# EAGLE design mega32_u4_simple_v2 (EAGLE 6.5.0)
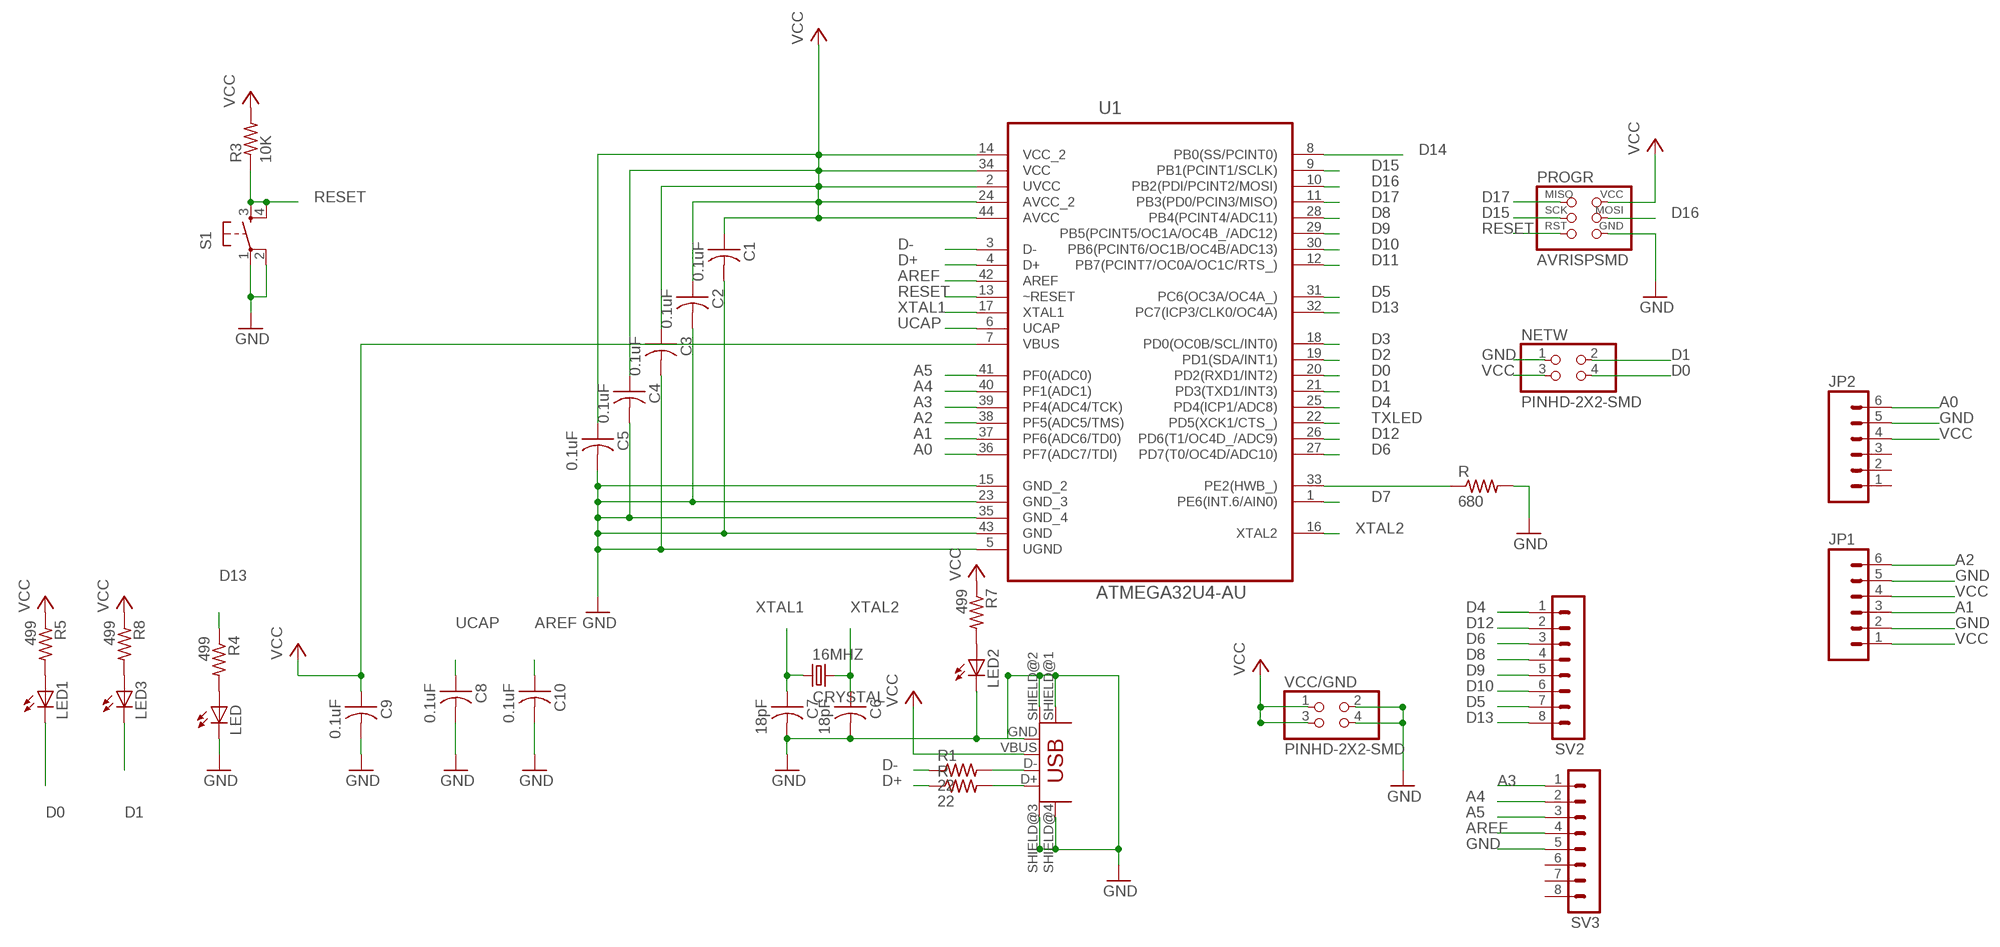
[diagram p0: schematic, sheet 1]

## Parts
16MHZ  CRYSTAL  [2-SMD-5X3MM]
C1  0.1uF  CAP-US1206FAB  [C1206FAB]
C2  0.1uF  CAP-US1206FAB  [C1206FAB]
C3  0.1uF  CAP-US1206FAB  [C1206FAB]
C4  0.1uF  CAP-US1206FAB  [C1206FAB]
C5  0.1uF  CAP-US1206FAB  [C1206FAB]
C6  18pF  CAP-US1206FAB  [C1206FAB]
C7  18pF  CAP-US1206FAB  [C1206FAB]
C8  0.1uF  CAP-US1206FAB  [C1206FAB]
C9  0.1uF  CAP-US1206FAB  [C1206FAB]
C10  0.1uF  CAP-US1206FAB  [C1206FAB]
JP1  M06SMD  [1X06-SMD]
JP2  M06SMD  [1X06-SMD]
LED  LED1206  [1206]
LED1  LED1206  [1206]
LED2  LED1206  [1206]
LED3  LED1206  [1206]
NETW  PINHD-2X2-SMD  [2X02SMD]
PROGR  AVRISPSMD  [2X03SMD]
R  680  RES-US1206FAB  [R1206FAB]
R1  22  RES-US1206FAB  [R1206FAB]
R3  10K  RES-US1206FAB  [R1206FAB]
R4  499  RESISTOR1206  [1206]
R5  499  RESISTOR1206  [1206]
R7  499  RESISTOR1206  [1206]
R8  499  RESISTOR1206  [1206]
R.  22  RES-US1206FAB  [R1206FAB]
S1  6MM_SWITCH6MM_SWITCH  [6MM_SWITCH]
SV2  MA08-1  [MA08-1]
SV3  MA08-1  [MA08-1]
U1  ATMEGA32U4-AU  [QFP80P1200X1200X120-44N]
U$1  USB_MINIB  [USB_MINIB]
VCC/GND  PINHD-2X2-SMD  [2X02SMD]

## Nets
A0: JP2.6 U1.36(PF7(ADC7/TDI))
A1: JP1.3 U1.37(PF6(ADC6/TD0))
A2: JP1.6 U1.38(PF5(ADC5/TMS))
A3: SV3.1 U1.39(PF4(ADC4/TCK))
A4: SV3.2 U1.40(PF1(ADC1))
A5: SV3.3 U1.41(PF0(ADC0))
AREF: C10.1 SV3.4 U1.42(AREF)
D0: LED1.2(C) NETW.4 U1.20(PD2(RXD1/INT2))
D1: LED3.2(C) NETW.2 U1.21(PD3(TXD1/INT3))
D2: U1.19(PD1(SDA/INT1))
D3: U1.18(PD0(OC0B/SCL/INT0))
D4: SV2.1 U1.25(PD4(ICP1/ADC8))
D5: SV2.7 U1.31(PC6(OC3A/OC4A_))
D6: SV2.3 U1.27(PD7(T0/OC4D/ADC10))
D7: U1.1(PE6(INT.6/AIN0))
D8: SV2.4 U1.28(PB4(PCINT4/ADC11))
D9: SV2.5 U1.29(PB5(PCINT5/OC1A/OC4B_/ADC12))
D10: SV2.6 U1.30(PB6(PCINT6/OC1B/OC4B/ADC13))
D11: U1.12(PB7(PCINT7/OC0A/OC1C/RTS_))
D12: SV2.2 U1.26(PD6(T1/OC4D_/ADC9))
D13: R4.1 SV2.8 U1.32(PC7(ICP3/CLK0/OC4A))
D14: U1.8(PB0(SS/PCINT0))
D15: PROGR.3(SCK) U1.9(PB1(PCINT1/SCLK))
D16: PROGR.4(MOSI) U1.10(PB2(PDI/PCINT2/MOSI))
D17: PROGR.1(MISO) U1.11(PB3(PD0/PCIN3/MISO))
D+: R..1 U1.4(D+)
D-: R1.1 U1.3(D-)
GND: C1.2 C2.2 C3.2 C4.2 C5.2 C6.2 C7.2 C8.2 C9.2 C10.2 JP1.2 JP1.5 JP2.5 LED2.2(C) LED.2(C) NETW.1 PROGR.6(GND) R.2 S1.1(P) S1.2(P1) SV3.5 U1.5(UGND) U1.15(GND_2) U1.23(GND_3) U1.35(GND_4) U1.43(GND) U$1.GND U$1.SHIELD@1(SHIELD) U$1.SHIELD@2(SHIELD1) U$1.SHIELD@3(SHIELD2) U$1.SHIELD@4(SHIELD3) VCC/GND.2 VCC/GND.4
N$1: R1.2 U$1.D-
N$2: R..2 U$1.D+
N$3: LED.1(A) R4.2
N$4: LED1.1(A) R5.2
N$5: LED2.1(A) R7.2
N$6: LED3.1(A) R8.2
N$35: R.1 U1.33(PE2(HWB_))
RESET: PROGR.5(RST) R3.1 S1.3(S) S1.4(S1) U1.13(~RESET)
TXLED: U1.22(PD5(XCK1/CTS_))
UCAP: C8.1 U1.6(UCAP)
VCC: C1.1 C2.1 C3.1 C4.1 C5.1 C9.1 JP1.1 JP1.4 JP2.4 NETW.3 PROGR.2(VCC) R3.2 R5.1 R7.1 R8.1 U1.2(UVCC) U1.7(VBUS) U1.14(VCC_2) U1.24(AVCC_2) U1.34(VCC) U1.44(AVCC) U$1.VBUS VCC/GND.1 VCC/GND.3
XTAL1: 16MHZ.P$1 C7.1 U1.17(XTAL1)
XTAL2: 16MHZ.P$2 C6.1 U1.16(XTAL2)
Unconnected: JP2.1 JP2.2 JP2.3 SV3.6 SV3.7 SV3.8

## Library data of the parts
16MHZ = fab:CRYSTAL
C1-C10 = fab:CAP-US
JP1 JP2 = 01_SparkFun:M06: Header 6 Standard 6-pin 0.1" header. Use with straight break away headers (SKU : PRT-00116), right angle break away headers (PRT-00553), swiss pins (PRT-00743), machine pins (PRT-00117), and female headers (PRT-00115). Molex polarized connector foot print use with SKU : PRT-08094 with associated crimp pins and housings. NOTES ON THE VARIANTS LOCK and LOCK_LONGPADS... This footprint was designed to help hold the alignment of a through-hole component (i.e. 6-pin header) while soldering it into place. You may notice that each hole has been shifted either up or down by 0.005 of an inch from it's more standard position (which is a perfectly straight line). This slight alteration caused the pins (the squares in the middle) to touch the edges of the holes. Because they are alternating, it causes a "brace" to hold the component in place. 0.005 has proven to be the perfect amount of "off-center" position when using our standard breakaway headers. Although looks a little odd when you look at the bare footprint, once you have a header in there, the alteration is very hard to notice. Also, if you push a header all the way into place, it is covered up entirely on the bottom side. This idea of altering the position of holes to aid alignment will be further integrated into the Sparkfun Library for other footprints. It can help hold any component with 3 or more connection pins.
LED LED1-LED3 = ng:LED
NETW VCC/GND = fab:PINHD-2X2-SMD
PROGR = fab:AVRISP
R R1 R3 R. = fab:RES-US: Resistor (US Symbol) Variants with postfix FAB are widened to allow the routing of internal traces
R4 R5 R7 R8 = ng:RESISTOR
S1 = ng:6MM_SWITCH: OMRON SWITCH
SV2 SV3 = con-lstb:MA08-1: PIN HEADER
U1 = Atmel_By_element14_Batch_1:ATMEGA32U4-AU: 8-bit Microcontroller with ISP Flash and USB Controller; MPN: ATMEGA32U4-AU; OC_FARNELL: 1748525; OC_NEWARK: 26R5633; PACKAGE: TQFP-44; SUPPLIER: Atmel
U$1 = fab:USB_MINIB

## Board
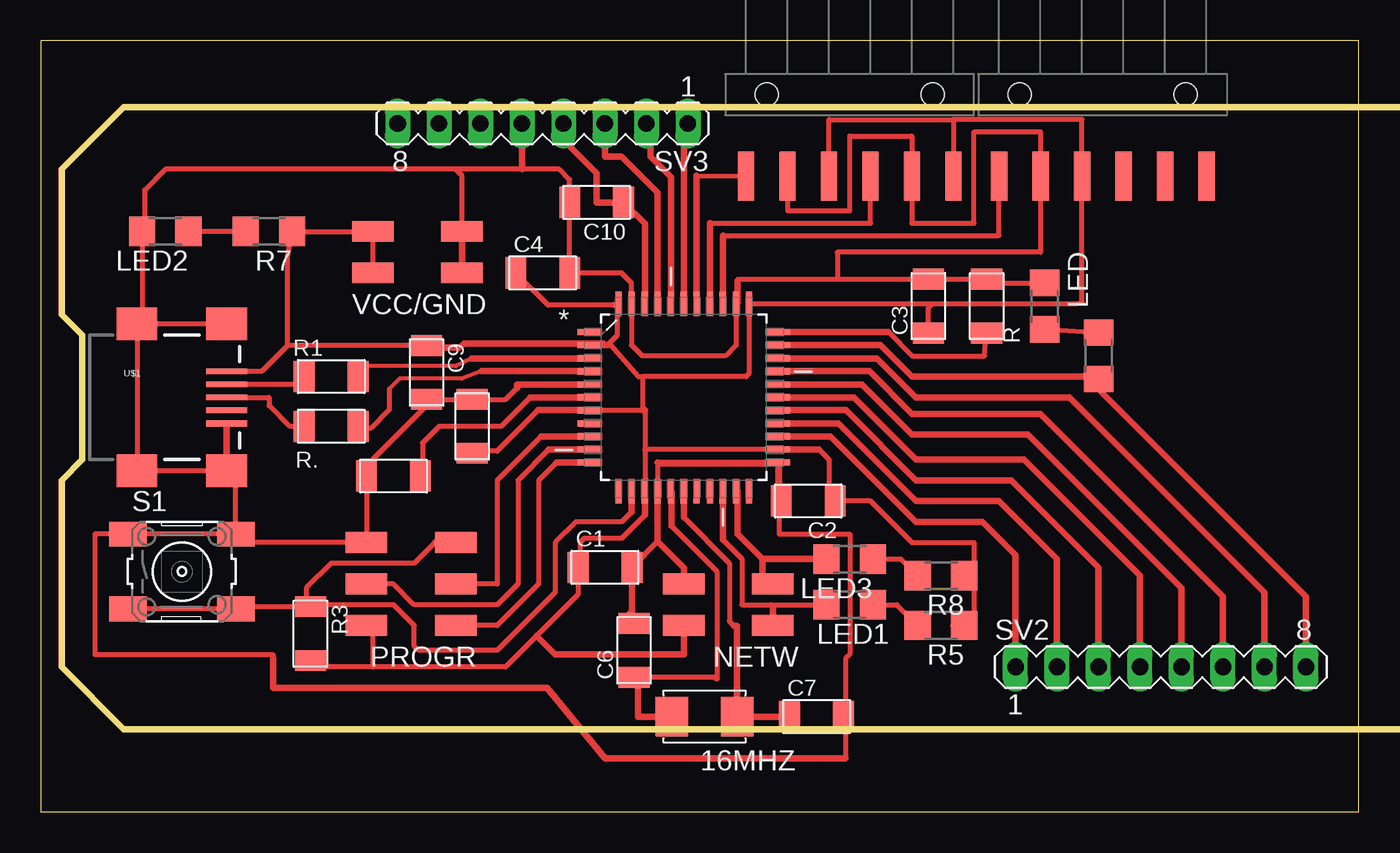
[diagram p1: board, top side]

Size 80.7 x 47.23 mm. Coordinates in mm from the lower left corner, seen from the top.
Outline: 0,0 80.7,0 80.7,47.23 0,47.23 0,0
Copper layers (1*16): Top 0.035mm / dielectric 1.5mm / Bottom 0.035mm
Design rules "default *": minimum track width 10mil, minimum drill 24mil, track to track 0.4mm, track to pad 0.4mm, pad to pad 0.4mm, via to via 0.4mm, smd to smd 0.4mm, copper to edge 40mil, drill to drill 0.4mm, minimum pad ring 10mil, minimum via ring 8mil, stop-mask expansion 4mil, vias tented up to drill 0mil, thermal gap 10mil
Milling: area 1.3,5.1 to 101.6,43.2

### Footprints (pad centres in the part's own frame; a part is rotated, then mirrored left to right if it is on the bottom)
2-SMD-5X3MM = smd 2 x 2.4: P$1 -2,0; P$2 2,0
C1206FAB = smd 1.27 x 1.905: 1 -1.651,0; 2 1.651,0
1X06-SMD = smd 1 x 3: 1 -6.35,5; 2 -3.81,5; 3 -1.27,5; 4 1.27,5; 5 3.81,5; 6 6.35,5 | hole 1.4: -5.08,0; 5.08,0
1206 = smd 1.6 x 1.803: 1 -1.422,0; 2 1.422,0
2X02SMD = smd 2.54 x 1.27: 1 -2.54,1.27; 2 2.92,1.27; 3 -2.54,-1.27; 4 2.92,-1.27
2X03SMD = smd 2.54 x 1.27: 1 -2.54,2.54; 2 2.92,2.54; 3 -2.54,0; 4 2.92,0; 5 -2.54,-2.54; 6 2.92,-2.54
R1206FAB = smd 1.27 x 1.905: 1 -1.651,0; 2 1.651,0
6MM_SWITCH = smd 2.286 x 1.524: 1 -3.302,2.286; 2 3.302,2.286; 3 -3.302,-2.286; 4 3.302,-2.286
MA08-1 = drill 1.016 long: 1 -8.89,0; 2 -6.35,0; 3 -3.81,0; 4 -1.27,0; 5 1.27,0; 6 3.81,0; 7 6.35,0; 8 8.89,0
QFP80P1200X1200X120-44N = smd 1.5 x 0.38: 1 -5.74,3.988; 2 -5.74,3.2; 3 -5.74,2.388; 4 -5.74,1.6; 5 -5.74,0.787; 6 -5.74,0; 7 -5.74,-0.787; 8 -5.74,-1.6; 9 -5.74,-2.388; 10 -5.74,-3.2; 11 -5.74,-3.988; 23 5.74,-3.988; 24 5.74,-3.2; 25 5.74,-2.388; 26 5.74,-1.6; 27 5.74,-0.787; 28 5.74,0; 29 5.74,0.787; 30 5.74,1.6; 31 5.74,2.388; 32 5.74,3.2; 33 5.74,3.988 | smd 0.38 x 1.5: 12 -3.988,-5.74; 13 -3.2,-5.74; 14 -2.388,-5.74; 15 -1.6,-5.74; 16 -0.787,-5.74; 17 0,-5.74; 18 0.787,-5.74; 19 1.6,-5.74; 20 2.388,-5.74; 21 3.2,-5.74; 22 3.988,-5.74; 34 3.988,5.74; 35 3.2,5.74; 36 2.388,5.74; 37 1.6,5.74; 38 0.787,5.74; 39 0,5.74; 40 -0.787,5.74; 41 -1.6,5.74; 42 -2.388,5.74; 43 -3.2,5.74; 44 -3.988,5.74
USB_MINIB = smd 2.5 x 0.35: D+ 3.77,0; D- 3.77,0.8; GND 3.77,-1.6; ID 3.77,-0.8; VBUS 3.77,1.6 | smd 2.5 x 2: SHIELD@1 -1.73,-4.5; SHIELD@2 -1.73,4.5; SHIELD@3 3.77,4.5; SHIELD@4 3.77,-4.5

### Placement (x,y rotation side)
16MHZ  40.64,5.84 180 top
C1  34.54,14.99 0 top
C2  46.99,19.05 180 top
C3  54.36,30.99 90 top
C4  30.73,33.02 0 top
C5  26.42,23.62 90 top
C6  36.32,9.91 90 top
C7  47.5,5.84 0 top
C8  21.59,20.57 180 top
C9  23.62,26.92 270 top
C10  34.04,37.34 180 top
JP1  49.53,43.94 180 top
JP2  65.02,43.94 180 top
LED  61.47,30.99 90 top
LED1  49.53,12.7 180 top
LED2  7.62,35.56 180 top
LED3  49.53,15.49 180 top
NETW  41.91,12.7 0 top
PROGR  22.86,13.97 180 top
R  57.91,30.99 90 top
R1  17.78,26.67 180 top
R3  16.51,10.92 270 top
R4  64.77,27.94 90 top
R5  55.12,11.43 180 top
R7  13.97,35.56 180 top
R8  55.12,14.48 180 top
R.  17.78,23.62 180 top
S1  8.64,14.73 0 top
SV2  68.58,8.89 0 top
SV3  30.73,42.16 180 top
U1  39.37,25.4 0 top
U$1  7.62,25.4 0 top
VCC/GND  22.86,34.29 0 top

### Tracks (layer width: path | path; a pad name or v marks a point on that pad's centre or on a via)
A0
  Top 0.305: 41.76,35.31 58.67,35.31 JP2.6 58.67,39.2
  Top 0.406: U1.36 41.76,35.31
A1
  Top 0.305: 40.97,36.07 50.8,36.07 JP1.3
  Top 0.406: U1.37 40.97,36.07
A2
  Top 0.305: U1.38 40.13,31.17 | 40.16,38.97 JP1.6
  Top 0.406: U1.38 40.16,38.97
A3
  Top 0.305: 39.37,41.66 39.62,41.91 SV3.1
  Top 0.406: 39.37,41.91 SV3.1 | U1.39 39.37,41.66
A4
  Top 0.406: SV3.2 37.34,41.91 37.34,40.13 38.58,38.89 U1.40
A5
  Top 0.406: SV3.3 34.54,40.13 35.56,40.13 37.77,37.92 U1.41
AREF
  Top 0.406: SV3.4 32,41.15 34.04,39.12 34.04,37.34 C10.1 36.98,36.04 U1.42
D0
  Top 0.305: 41.76,16.66 42.93,15.49 42.93,12.7 44.7,12.7 | 44.7,12.7 LED1.2 | 44.83,12.57 44.7,12.7
  Top 0.406: NETW.4 44.83,12.57 | U1.20 41.76,16.66
D1
  Top 0.406: U1.21 42.67,19.66 42.67,17.02 44.2,15.49 | 44.2,15.49 LED3.2 | 44.2,15.49 44.2,13.97 NETW.2
D4
  Top 0.406: U1.25 48.36,23.01 53.59,17.78 57.66,17.78 59.69,15.75 SV2.1
D5
  Top 0.406: U1.31 51.21,27.79 53.59,25.4 62.99,25.4 74.93,13.46 SV2.7
D6
  Top 0.406: U1.27 49.3,24.61 53.59,20.32 59.44,20.32 64.77,14.99 SV2.3
D8
  Top 0.406: U1.28 49.78,25.4 53.59,21.59 60.2,21.59 67.31,14.48 SV2.4
D9
  Top 0.406: U1.29 50.27,26.19 53.34,23.11 60.45,23.11 69.85,13.72 SV2.5
D10
  Top 0.406: U1.30 50.72,27 53.34,24.38 61.21,24.38 72.39,13.21 SV2.6
D12
  Top 0.406: U1.26 48.84,23.8 53.59,19.05 58.67,19.05 62.23,15.49 SV2.2
D13
  Top 0.406: U1.32 51.41,28.6 53.34,26.67 64.62,26.67 R4.1 64.92,26.52 64.92,25.76 77.47,13.21 SV2.8
D15
  Top 0.305: 30.63,23.01 27.94,20.32 27.94,13.97 PROGR.3
  Top 0.406: U1.9 30.63,23.01
D16
  Top 0.305: 31.09,22.2 29.21,20.32 29.21,13.97 27.94,12.7 22.86,12.7 21.59,13.97 PROGR.4
  Top 0.406: U1.10 31.09,22.2
D17
  Top 0.305: 31.57,21.41 30.48,20.32 30.48,13.97 27.94,11.43 PROGR.1
  Top 0.406: U1.11 31.57,21.41
D+
  Top 0.254: 27,27 25.78,26.54 21.97,26.54 21.34,25.91
  Top 0.305: 21.34,25.91 21.34,24.64 20.19,23.5 19.56,23.5 R..1
  Top 0.406: U1.4 27,27
D-
  Top 0.254: 26.39,27.79 25.4,27.3 19.56,27.3
  Top 0.305: 19.56,27.3 19.3,26.8 R1.1
  Top 0.406: U1.3 26.39,27.79
GND
  Top 0.305: U$1.SHIELD@4 U$1.SHIELD@1 U$1.SHIELD@2 U$1.SHIELD@3 | C9.2 C5.2 28.45,25.27 29.15,25.97 29.36,26.19 | LED2.2 6.2,30.21 | C3.2 R.2 | 58.9,32.38 LED.2 | 45.11,19.28 U1.23 37.77,21.41 U1.15 | 37.77,16.56 C1.2 | PROGR.6 11.94,16.51 | U1.35 42.57,28.6 41.91,27.94 36.83,27.94 36.17,28.6 U1.43 36.17,32.41 35.56,33.02 C4.2 C10.2 32.38,38.74 31.75,39.37 29.46,39.37 25.4,39.37 | C8.2 PROGR.6 | 11.94,20.35 S1.2 S1.1 3.3,17.02 3.3,9.65 14.22,9.65 14.22,9.4 | 25.4,39.37 7.62,39.37 6.35,38.1 6.35,35.71 | VCC/GND.4 25.78,38.99 25.4,39.37 | 23.62,24.89 20.32,21.59 20.32,20.95 | C7.2 49.28,5.71 | 49.28,5.71 49.28,3.3 | 45.21,19.81 45.21,17.02 49.53,17.02 49.53,9.65 49.28,9.4 49.28,5.71 | C3.2 54.23,32.51 | 42.67,32.51 42.67,32.64 48.77,32.64 | 48.77,32.64 C3.2 | 48.77,32.64 48.77,34.29 61.21,34.29 JP2.5 61.21,41.66 57.15,41.66 57.15,36.07 53.34,36.07 JP1.2 53.34,41.4 49.53,41.4 49.53,36.83 45.72,36.83 JP1.5
  Top 0.406: U$1.GND U$1.SHIELD@4 11.94,20.35 | U$1.SHIELD@3 11.43,29.9 | 6.2,30.21 U$1.SHIELD@2 | R.2 58.9,32.38 | 45.11,19.28 C2.2 | 11.94,16.51 S1.2 | VCC/GND.2 VCC/GND.4 | C9.2 23.62,24.89 | 20.32,20.95 C8.2 | PROGR.6 | 6.35,35.71 LED2.2 | SV3.5 29.46,39.37 | NETW.1 39.37,14.96 37.77,16.56 U1.15 | C1.2 36.2,12.32 36.07,12.19 36.07,11.81 C6.2 | 49.28,3.3 34.54,3.3 30.99,7.62 14.22,7.62 14.22,9.4 | 37.77,21.41 37.85,21.34 45.21,21.34 45.21,19.81 | U1.5 29.15,26.19 29.15,25.97 | U1.35 42.67,31.14 42.67,32.51
N$1
  Top 0.305: U$1.D- 16.13,26.2
  Top 0.406: 16.13,26.2 R1.2
N$2
  Top 0.305: R..2 15.24,23.62 13.97,24.89 13.97,25.4 U$1.D+
N$3
  Top 0.305: LED.1 R4.2
N$4
  Top 0.305: LED1.1 52.43,12.7 R5.2
N$5
  Top 0.305: R7.2 LED2.1
N$6
  Top 0.305: LED3.1 52.68,15.49 R8.2
N$35
  Top 0.305: 51.89,29.39 53.34,27.94 57.79,27.94 R.1
  Top 0.406: U1.33 51.89,29.39
RESET
  Top 0.305: S1.4 S1.3 | 36.17,18.39 35.56,17.78 32.77,17.78 31.5,16.51 31.5,13.46 27.94,9.91 23.11,9.91 22.86,10.16 22.86,11.43 21.59,12.7 16.64,12.7 | 24.13,16.51 22.86,15.24 17.78,15.24 16.26,13.72 16.26,12.83 R3.1 11.94,12.57
  Top 0.406: 16.64,12.7 R3.1 | PROGR.5 24.13,16.51 | 11.94,12.57 S1.4 | U1.13 36.17,18.39
UCAP
  Top 0.305: 29.97,25.4 28.19,23.62 24.38,23.62 23.37,22.61 23.37,20.7 C8.1
  Top 0.406: U1.6 29.97,25.4
VCC
  Top 0.305: 34.7,28.6 35.31,29.21 35.31,31.06 | 30.45,24.61 27.94,22.1 26.04,22.1 C5.1 | C9.1 15.11,28.57 | 15.11,28.57 13.54,27 U$1.VBUS | 15.11,28.57 15.11,34.01 R7.1 VCC/GND.1 VCC/GND.3 | 47.65,22.2 48.26,21.59 48.26,19.43 | 35.13,31.04 31.06,31.04 C4.1 | C2.1 50.8,19.05 53.34,16.51 57.15,16.51 57.15,14.12 57.15,11.43 | 36.98,18.19 35.56,16.76 33.27,16.76 33.02,16.51 33.02,15.11 | 20.32,8.89 16.89,8.89 R3.2 | 20.32,11.43 20.32,8.89 | 34.54,28.6 34.9,28.6 36.58,26.67 36.83,26.67 | C1.1 32.89,13.33 30.35,10.79 28.45,8.89 20.32,8.89 | 36.83,26.67 43.18,26.67 43.36,26.85 U1.34 54.61,31.14 | U1.7 36.83,24.61 36.83,26.67 | 36.98,24.61 36.98,22.2 | 36.98,22.2 U1.14 | U1.24 36.98,22.2 | 54.61,31.14 63.4,31.14 63.75,31.24 JP2.4 63.75,42.42 55.88,42.42 | C3.1 54.36,30.89 54.61,31.14 | JP1.4 48.26,42.42 55.88,42.42 | 55.88,42.42 JP1.1 | 23.65,28.6 23.62,28.6 23.62,28.45 23.37,28.45
  Top 0.406: U1.2 34.54,28.6 | 34.54,28.6 34.7,28.6 | 35.31,31.06 U1.44 35.13,31.04 | 43.43,31.06 U1.34 | 23.65,28.6 C9.1 | 29.21,32.89 C4.1 | 48.26,19.43 C2.1 | 57.15,14.12 R8.1 | 57.15,11.43 R5.1 55.88,11.43 | 33.02,15.11 C1.1 | PROGR.2 20.32,11.43 | 36.83,24.61 36.98,24.61 | NETW.3 39.37,9.65 31.5,9.65 30.35,10.79 | U1.7 30.45,24.61 | U1.14 36.98,18.19 | U1.24 47.65,22.2 | 23.62,28.45 25.65,28.45 25.91,28.7 34.44,28.7 34.54,28.6
XTAL1
  Top 0.305: 39.37,18.03 42.16,15.24 42.16,11.68 42.45,11.4
  Top 0.406: C7.1 16MHZ.P$1 42.64,11.4 42.45,11.4 | U1.17 39.37,18.03
XTAL2
  Top 0.305: U1.16 38.61,19.63 | 38.61,17.53 41.4,14.73 41.4,8.13 41.27,8.26 C6.1
  Top 0.406: C6.1 36.58,8 36.58,5.84 16MHZ.P$2 | 38.61,19.63 38.61,17.53